# EAGLE design li-ION BATTERY Charger (EAGLE 9.6.2)
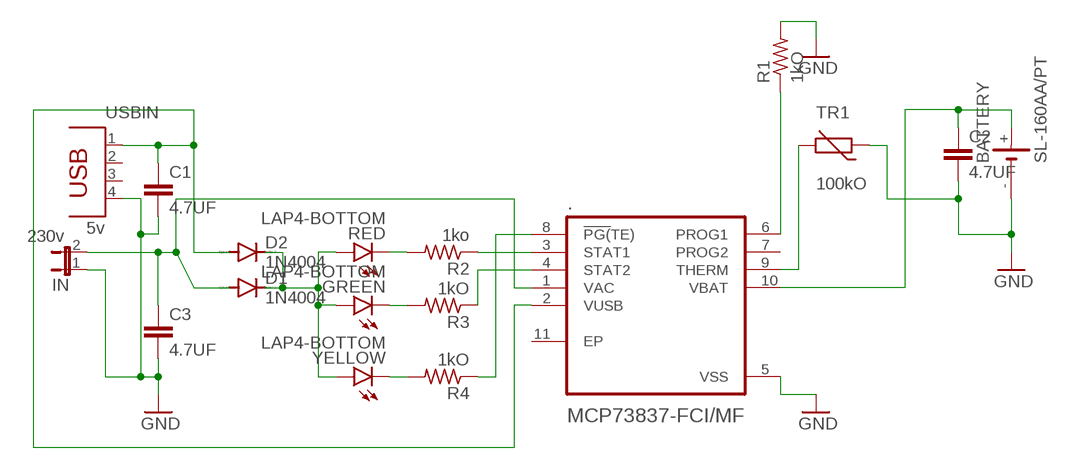
[diagram p0: schematic, sheet 1]

## Parts
.  MCP73837-FCI/MF  [DFN300X300X100-11N]
BATTERY  SL-160AA/PT  [SL-160AA/PT]
C1  4.7UF  C5/2.5  [C5B2.5]
C2  4.7UF  C5/2.5  [C5B2.5]
C3  4.7UF  C5/2.5  [C5B2.5]
D1  1N4004  [DO41-10]
D2  1N4004  [DO41-10]
GREEN  LAP4-BOTTOM  [P47F-BOTTOM]
IN  230v  JP1E  [JP1]
R1  1kO  R-US_0309/12  [0309/12]
R2  1ko  R-US_0309/12  [0309/12]
R3  1kO  R-US_0309/12  [0309/12]
R4  1kO  R-US_0309/12  [0309/12]
RED  LAP4-BOTTOM  [P47F-BOTTOM]
TR1  100kO  THERMISTOR_R-7,5  [R-7,5]
USBIN  5v  PN87520  [PN87520]
YELLOW  LAP4-BOTTOM  [P47F-BOTTOM]

## Nets
GND: ..5(VSS) BATTERY.- C1.2 C2.2 C3.2 IN.1 R1.2 TR1.1 USBIN.4
N$1: ..3(STAT1) R2.1
N$2: ..1(VAC) C3.1 D1.A IN.2
N$3: ..4(STAT2) R3.1
N$4: ..10(VBAT) BATTERY.+ C2.1
N$5: GREEN.C R3.2
N$6: R2.2 RED.C
N$7: R4.2 YELLOW.C
N$8: ..8(!PG(!TE)) R4.1
N$9: ..9(THERM) TR1.2
N$10: ..6(PROG1) R1.1
N$11: D1.C D2.C GREEN.A RED.A YELLOW.A
N$14: ..2(VUSB) C1.1 D2.A USBIN.1
Unconnected: ..7(PROG2) ..11(EP) BATTERY.-@1(-) USBIN.2 USBIN.3

## Library data of the parts
. = MCP73837-FCI_MF:MCP73837-FCI/MF; AVAILABILITY: Unavailable; DESCRIPTION: Charger IC Lithium Ion/Polymer 10-DFN (3x3); MF: Microchip; MP: MCP73837-FCI/MF; PACKAGE: DFN-10 Microchip; PRICE: None
BATTERY = battery:SL-160AA/PT: LI BATTERY Sonnenschein
C1-C3 = capacitor-wima:C: CAPACITOR naming: grid - package width
D1 D2 = diode:1N4004: DIODE general purpose rectifier, 1 A
GREEN RED YELLOW = led:*P4: PointLED® Enhanced Thinfilm LED TOP & BOTTOM mount LS P47F, LR P47F, LA P47F, LY P47F, LT P4SG, LB P4SG, LW P4SG Source: http://catalog.osram-os.com .. LA_LR_LS_LY_P47F_Pb_free.pdf
IN = jumper:JP1E: JUMPER
R1-R4 = rcl:R-US_: RESISTOR, American symbol; SPICEPREFIX: R
TR1 = discrete:THERMISTOR_: Thermo Resistor
USBIN = con-berg:PN87520: BERG USB connector; OC_FARNELL: unknown; OC_NEWARK: unknown

## Board
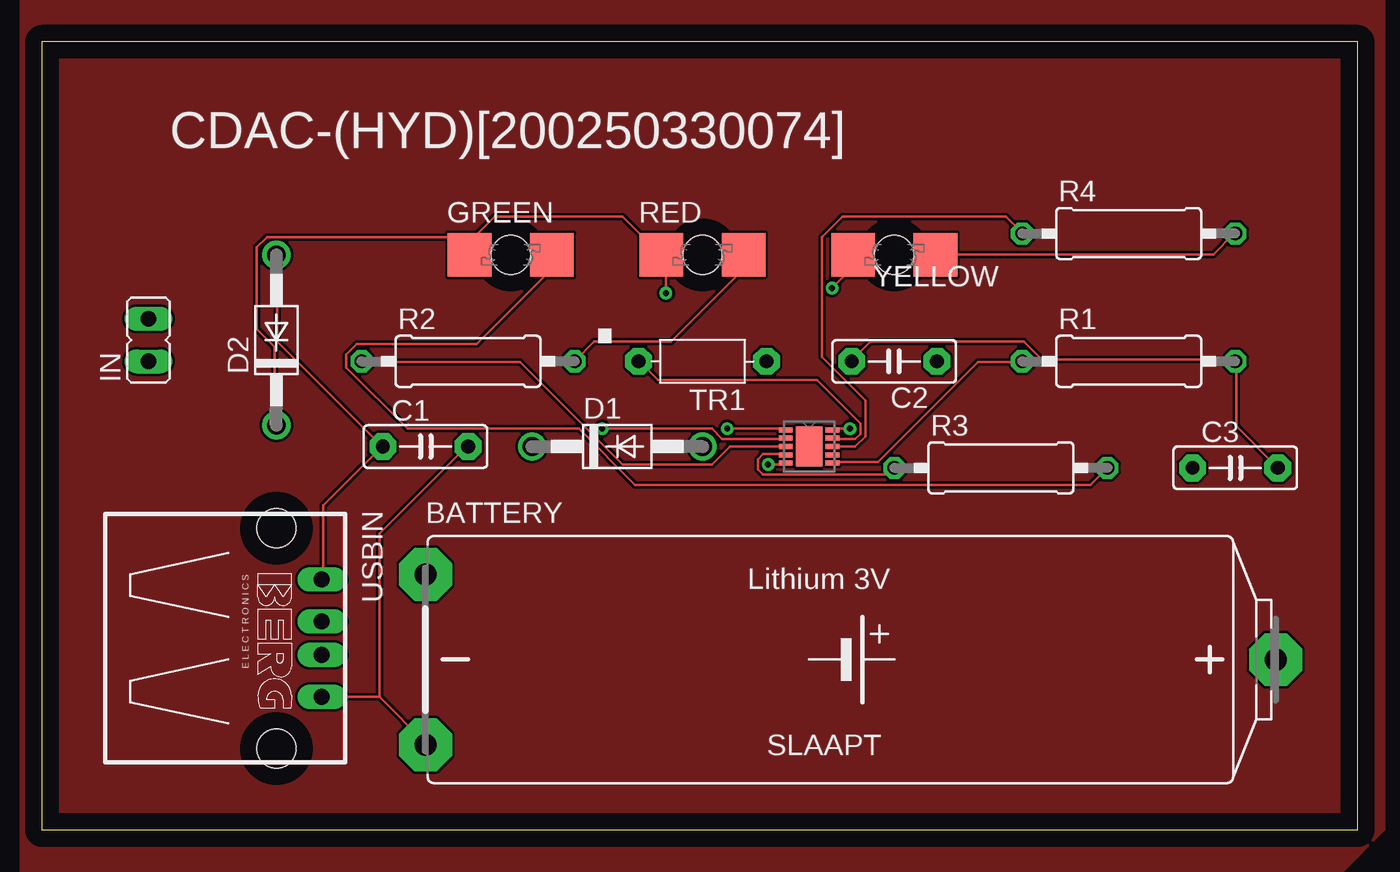
[diagram p1: board, top side]
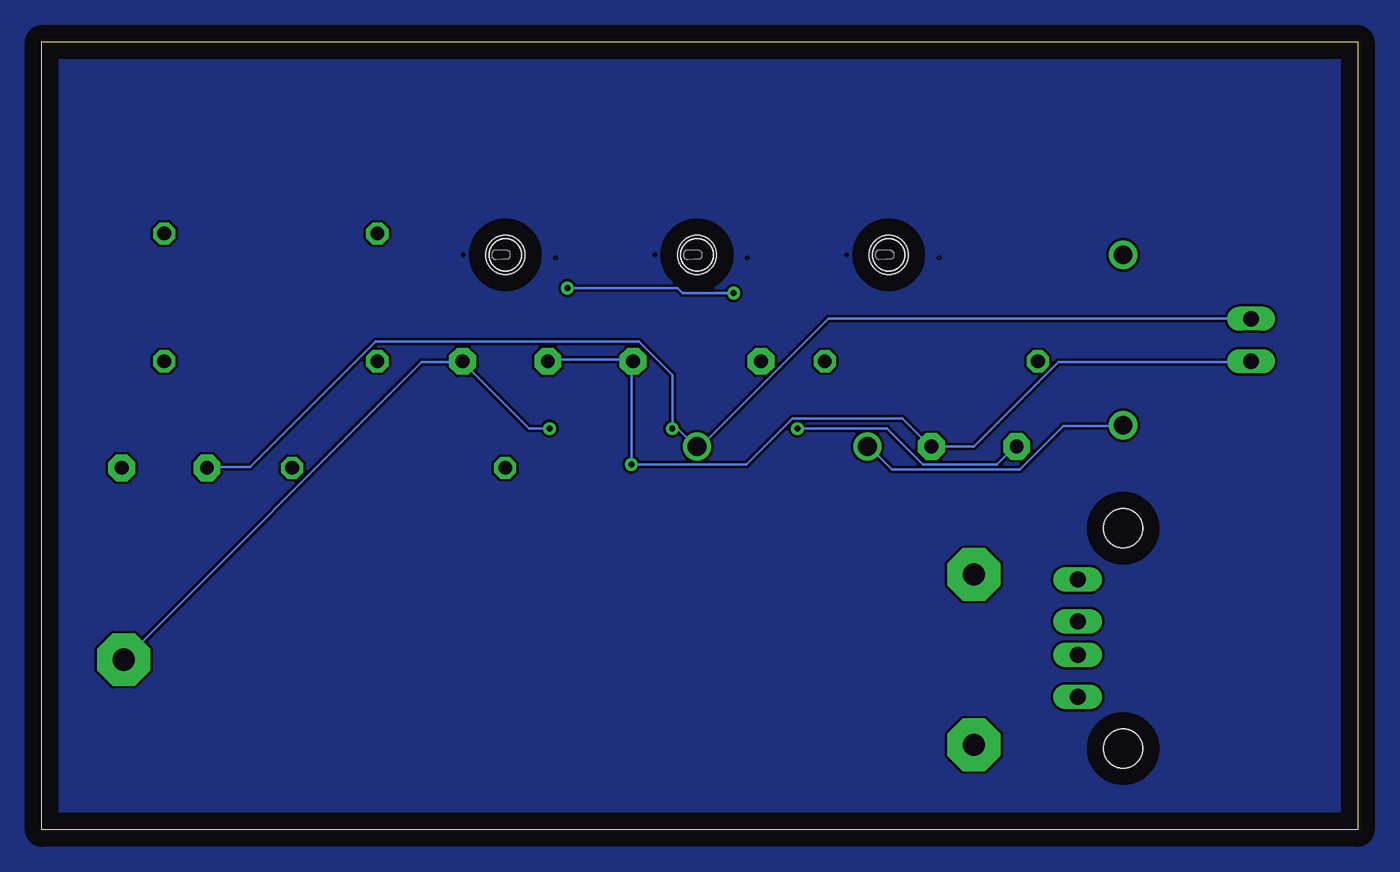
[diagram p2: board, bottom side, seen from below]

Size 78.41 x 46.98 mm. Coordinates in mm from the lower left corner, seen from the top.
Outline: 0,0 78.41,0 78.41,46.98 0,46.98 0,0
Copper layers (1*16): Top 0.035mm / dielectric 1.5mm / Bottom 0.035mm
Design rules "default": minimum track width 6mil, minimum drill 0.35mm, track to track 6mil, track to pad 6mil, pad to pad 6mil, via to via 6mil, smd to smd 6mil, copper to edge 40mil, drill to drill 6mil, minimum pad ring 10mil, minimum via ring 8mil, stop-mask expansion 4mil, vias tented up to drill 0mil, thermal gap 10mil

### Footprints (pad centres in the part's own frame; a part is rotated, then mirrored left to right if it is on the bottom)
DFN300X300X100-11N = smd 0.813 x 0.305: 1 -1.397,0.991; 2 -1.397,0.508; 3 -1.397,0; 4 -1.397,-0.508; 5 -1.397,-0.991; 6 1.397,-0.991; 7 1.397,-0.508; 8 1.397,0; 9 1.397,0.508; 10 1.397,0.991 | smd 1.575 x 2.362: 11 0,0
SL-160AA/PT = drill 1.321 pad 3.15 octagon: + 25.273,0; - -25.4,-5.08; -@1 -25.4,5.08
C5B2.5 = drill 0.813 pad 1.6 octagon: 1 -2.54,0; 2 2.54,0
DO41-10 = drill 1.118: A 5.08,0; C -5.08,0
P47F-BOTTOM = smd 2.6 x 2.6: A -2.45,0; C 2.45,0 | hole 2.3: 0,0
JP1 = drill 0.914 long: 1 0,-1.27; 2 0,1.27
0309/12 = drill 0.813 octagon: 1 -6.35,0; 2 6.35,0
R-7,5 = drill 0.813 pad 1.6 octagon: 1 -3.81,0; 2 3.81,0
PN87520 = drill 0.95 long: 1 -3.5,2.71; 2 -1,2.71; 3 1,2.71; 4 3.5,2.71 | hole 2.3: -6.57,0; 6.57,0

### Placement (x,y rotation side)
.  45.72,22.86 0 top
BATTERY  48.26,10.16 0 top
C1  22.86,22.86 0 top
C2  50.8,27.94 180 top
C3  71.12,21.59 0 top
D1  34.29,22.86 0 top
D2  13.97,29.21 90 top
GREEN  27.94,34.29 0 top
IN  6.35,29.21 0 top
R1  64.77,27.94 0 top
R2  25.4,27.94 0 top
R3  57.15,21.59 0 top
R4  64.77,35.56 0 top
RED  39.37,34.29 0 top
TR1  39.37,27.94 180 top
USBIN  13.97,11.43 270 top
YELLOW  50.8,34.29 0 top

### Tracks (layer width: path | path; a pad name or v marks a point on that pad's centre or on a via)
BOTTOM
  pour Top: -2.54,50.8 78.74,50.8 80.01,49.53 80.01,0 77.47,-2.54 -1.27,-2.54 -1.27,49.53
GND  (via drill 0.35)
  Top 0.152: C3.2 71.17,24.08 71.17,27.89 R1.2 71.02,28.04 59.59,28.04 58.52,29.11 49.38,29.11 48.31,28.04 C2.2 | v43.28,21.79 44.2,21.79 ..5 | 20.12,7.92 16.76,7.92 USBIN.4 | 20.12,7.92 22.86,5.18 BATTERY.- | 20.12,7.92 20.12,17.68 25.3,22.86 C1.2
  Bottom 0.152: C2.2 48.16,28.04 43.28,28.04 TR1.1 43.28,27.89 v43.28,21.79 36.42,21.79 33.68,24.54 27.13,24.54 25.45,22.86 C1.2 22.86,22.86 17.83,27.89 6.4,27.89 IN.1
N$1
  Top 0.152: ..3 41,22.86 39.93,21.79 34.59,21.79 28.5,27.89 19.05,27.89 R2.1
N$2  (via drill 0.35)
  Top 0.152: v40.84,23.93 44.2,23.93 ..1
  Bottom 0.152: IN.2 31.55,30.48 39.17,22.86 D1.A 39.47,22.86 40.54,23.93 v40.84,23.93 40.84,27.13 42.82,29.11 58.52,29.11 65.99,21.64 68.58,21.64 C3.1
N$3
  Top 0.152: ..4 44.2,22.4 42.98,22.4 42.67,22.1 42.67,21.49 42.98,21.18 50.44,21.18 50.75,21.49 R3.1
N$4  (via drill 0.35)
  Top 0.152: v48.16,23.93 47.24,23.93 ..10
  Bottom 0.152: v48.16,23.93 49.38,23.93 53.34,27.89 | 53.34,27.89 55.78,27.89 73.46,10.21 BATTERY.+ | 53.34,27.89 C2.1
N$5
  Top 0.152: R3.2 62.48,20.57 35.36,20.57 32,23.93 21.79,23.93 18.14,27.58 18.14,28.35 18.75,28.96 25.91,28.96 30.33,33.38 30.33,34.29 GREEN.C
N$6
  Top 0.152: R2.2 32.92,29.11 37.49,29.11 41.76,33.38 41.76,34.29 RED.C
N$7
  Top 0.152: YELLOW.C 69.8,34.29 71.02,35.51 R4.2
N$8
  Top 0.152: ..8 48.46,22.86 49.07,23.47 49.07,25.6 46.48,28.19 46.48,35.36 47.7,36.58 57.45,36.58 58.37,35.66 R4.1
N$9
  Top 0.152: ..9 47.24,23.32 48.46,23.32 48.77,23.62 48.77,24.23 46.18,26.82 36.73,26.82 35.66,27.89 TR1.2
N$10
  Top 0.152: ..6 47.24,21.95 49.84,21.95 55.78,27.89 58.37,27.89 R1.1
N$11  (via drill 0.35)
  Top 0.152: 25.76,35.36 26.98,36.58 34.59,36.58 36.88,34.29 RED.A 37.03,34.29 37.03,33.83 37.19,33.68 v37.19,32 | 25.76,35.36 25.6,35.2 25.6,34.29 GREEN.A 25.76,35.36 | v47.09,32.31 48.31,33.53 48.31,34.29 YELLOW.A | 25.76,35.36 13.41,35.36 12.8,34.75 12.8,29.87 13.87,28.8 13.87,24.23 D2.C
  Bottom 0.152: D2.C 14.02,24.08 17.53,24.08 20.12,21.49 27.74,21.49 29.11,22.86 D1.C | v47.09,32.31 40.54,32.31 40.23,32 v37.19,32
N$14  (via drill 0.35)
  Top 0.152: v33.38,23.93 39.93,23.93 40.54,23.32 44.2,23.32 ..2 | 20.27,22.86 16.76,19.36 16.76,14.94 USBIN.1 | 20.27,22.86 14.02,29.11 14.02,34.29 D2.A | 20.27,22.86 C1.1
  Bottom 0.152: v33.38,23.93 28.04,23.93 25.91,21.79 21.49,21.79 20.42,22.86 C1.1
TOP
  pour Bottom: -5.08,53.34 82.55,53.34 82.55,-3.81 81.28,-5.08 78.74,-7.62 -3.81,-7.62 -5.08,-6.35

### Text on the board
tPlace: CDAC-(HYD)[200250330074]